# Altium project PCB_Project1.PrjPCB
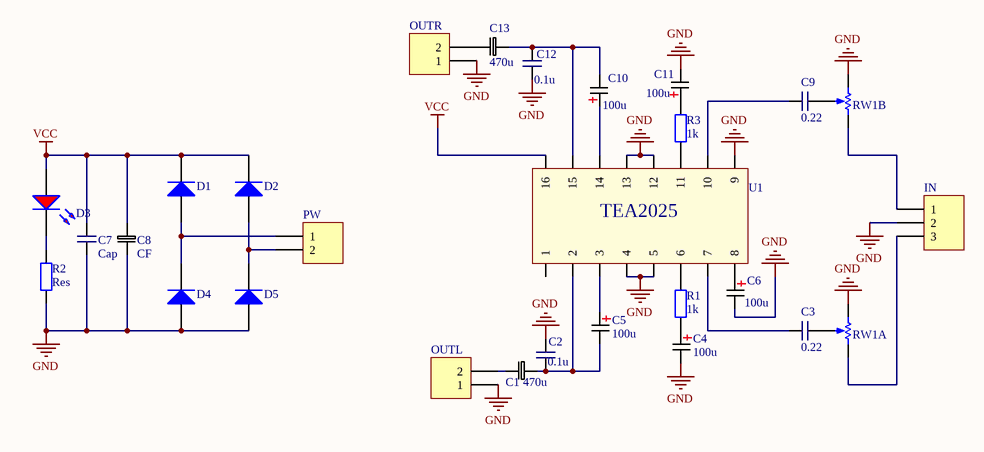
[diagram p0: Sheet1.SchDoc]
1 sheet, 27 parts. Net scope: global (net labels, ports and power ports of the same name join across sheets).
Board file: PCB1.PcbDoc

## Sheet Sheet1.SchDoc
size A4

### Parts
C1  470u  [CF0.1-6.5]
C2  0.1u  [RAD0.1]
C3  0.22  [RAD-0.2]
C4  100u  [CF0.1]
C5  100u  [CF0.1]
C6  100u  [CF0.1]
C7  Cap  [RAD0.1]
C8  CF  [CF0.2-13]
C9  0.22  [RAD-0.2]
C10  100u  [CF0.1]
C11  100u  [CF0.1]
C12  0.1u  [RAD0.1]
C13  470u  [CF0.1-6.5]
D1  Diode 1N4007  [DIO10.46-5.3x2.8]  (value not drawn)
D2  Diode 1N4007  [DIO10.46-5.3x2.8]  (value not drawn)
D3  LED0  [LED]  (value not drawn)
D4  Diode 1N4007  [DIO10.46-5.3x2.8]  (value not drawn)
D5  Diode 1N4007  [DIO10.46-5.3x2.8]  (value not drawn)
IN  (no value)  [HDR1X3]
OUTL  Header 2  [HDR1X2]  (value not drawn)
OUTR  Header 2  [HDR1X2]  (value not drawn)
PW  Header 2  [HDR1X2]  (value not drawn)
R1  1k  [RAD-0.1]
R2  Res  [AXIAL-0.3]
R3  1k  [RAD-0.1]
RW1  RW  [RW]  (value not drawn)  (parts A,B of 2)
U1  TEA2025  [DIP16]  (value not drawn)

### Nets
GND: C2.1 C4.2 C6.2 C7.1 C8.2 C11.2 C12.2 D4.1(A) D5.1(A) IN.2 OUTL.1 OUTR.1 R2.1 RW1.1(TOP) RW1.4(TOP) U1.4 U1.5 U1.9 U1.12 U1.13
VCC: C7.2 C8.1 D1.2(K) D2.2(K) D3.1(A) U1.16
NetC1_1: C1.1 C2.2 C5.2 U1.2
NetC1_2: C1.2 OUTL.2
NetC3_1: C3.1 RW1.2(TAP)
NetC3_2: C3.2 U1.7
NetC4_1: C4.1 R1.2
NetC5_1: C5.1 U1.3
NetC6_1: C6.1 U1.8
NetC9_1: C9.1 RW1.5(TAP)
NetC9_2: C9.2 U1.10
NetC10_1: C10.1 U1.14
NetC10_2: C10.2 C12.1 C13.1 U1.15
NetC11_1: C11.1 R3.1
NetC13_2: C13.2 OUTR.2
NetD1_1: D1.1(A) D4.2(K) PW.1
NetD2_1: D2.1(A) D5.2(K) PW.2
NetD3_2: D3.2(K) R2.2
NetIN_1: IN.1 RW1.6(BOT)
NetIN_3: IN.3 RW1.3(BOT)
NetR1_1: R1.1 U1.6
NetR3_2: R3.2 U1.11

Not connected (* = marked no-connect by the designer): U1 1

### Library data of the parts
C1 C13 = CF
C2 C3 C9 C12 = Cap
C4-C6 C10 C11 = Cap Pol
D1 D2 D4 D5 = Diode 1N4007: 1 Amp General Purpose Rectifier; Published: 8-Jun-2000; LatestRevisionDate: 17-Jul-2002; LatestRevisionNote: Re-released for DXP Platform.; DatasheetVersion: 1998; PackageVersion: Aug-1999; PackageReference: DO-41; Publisher: Altium Limited; Code_JEDEC: DO-204-AL; ComponentLink1Description: Manufacturer Link; ComponentLink1URL: http://www.fairchildsemi.com/; ComponentLink2Description: Datasheet; ComponentLink2URL: http://www.fairchildsemi.com/ds/1N%2F1N4001.pdf
IN = Header 3H: Header, 3-Pin, Right Angle; LatestRevisionDate: 17-Jul-2002; LatestRevisionNote: Re-released for DXP Platform.; Publisher: Altium Limited
OUTL OUTR PW = Header 2: Header, 2-Pin; LatestRevisionDate: 17-Jul-2002; LatestRevisionNote: Re-released for DXP Platform.; Publisher: Altium Limited
R1 R3 = Res: Resistor; Published: 8-Jun-2000; LatestRevisionDate: 17-Jul-2002; LatestRevisionNote: Re-released for DXP Platform.; PackageReference: AXIAL-0.4; Publisher: Altium Limited; Value: 1K
R2 = Res: Resistor; Value: 1K; Published: 8-Jun-2000; LatestRevisionDate: 17-Jul-2002; LatestRevisionNote: Re-released for DXP Platform.; PackageReference: AXIAL-0.4; Publisher: Altium Limited
D3 = LED0: Published: 8-Jun-2000; LatestRevisionDate: 08-Jul-2005; LatestRevisionNote: Mech Layer 1 removed.; PackageReference: LED-0; Publisher: Altium Limited